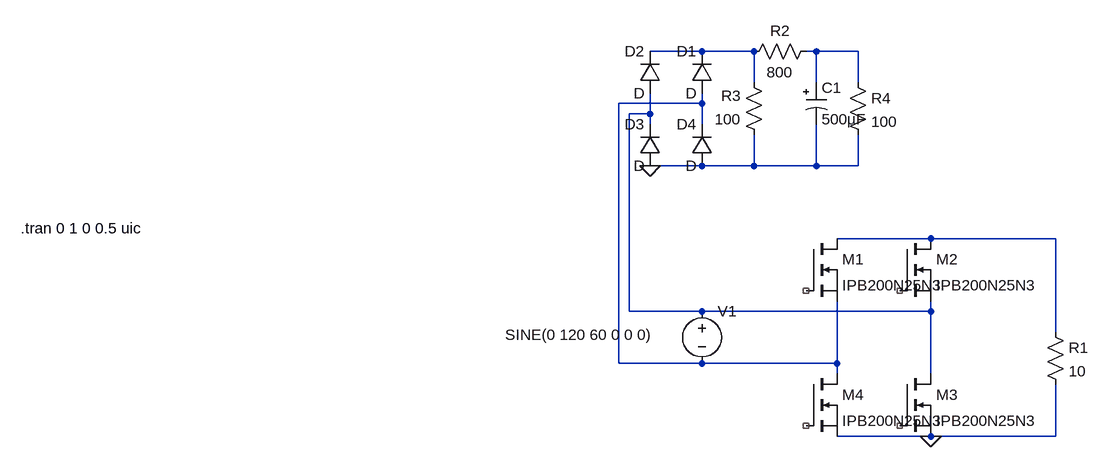
[diagram p0: schematic psu.asc]
psu.asc, the LTspice schematic file:
Version 4
SHEET 1 880 680
WIRE 80 -288 0 -288
WIRE 160 -288 80 -288
WIRE 256 -288 240 -288
WIRE 320 -288 256 -288
WIRE 160 -240 160 -288
WIRE 256 -240 256 -288
WIRE 320 -240 320 -288
WIRE 80 -208 80 -224
WIRE 80 -208 -48 -208
WIRE 0 -192 0 -224
WIRE 0 -192 -32 -192
WIRE 0 -176 0 -192
WIRE 80 -176 80 -208
WIRE 80 -112 0 -112
WIRE 160 -112 160 -160
WIRE 160 -112 80 -112
WIRE 256 -112 256 -176
WIRE 256 -112 160 -112
WIRE 320 -112 320 -160
WIRE 320 -112 256 -112
WIRE 432 0 288 0
WIRE 624 0 432 0
WIRE -32 112 -32 -192
WIRE 80 112 -32 112
WIRE 432 112 432 96
WIRE 432 112 80 112
WIRE 624 144 624 0
WIRE -48 192 -48 -208
WIRE 80 192 -48 192
WIRE 288 192 288 96
WIRE 288 192 80 192
WIRE 288 208 288 192
WIRE 432 208 432 112
WIRE 432 304 288 304
WIRE 624 304 624 224
WIRE 624 304 432 304
FLAG 432 304 0
FLAG 0 -112 0
SYMBOL voltage 80 96 R0
WINDOW 3 -303 52 Left 2
WINDOW 123 0 0 Left 0
WINDOW 39 0 0 Left 0
SYMATTR Value SINE(0 120 60 0 0 0)
SYMATTR InstName V1
SYMBOL res 608 128 R0
SYMATTR InstName R1
SYMATTR Value 10
SYMBOL nmos 240 0 R0
SYMATTR InstName M1
SYMATTR Value IPB200N25N3
SYMBOL nmos 384 0 R0
SYMATTR InstName M2
SYMATTR Value IPB200N25N3
SYMBOL nmos 384 208 R0
SYMATTR InstName M3
SYMATTR Value IPB200N25N3
SYMBOL nmos 240 208 R0
SYMATTR InstName M4
SYMATTR Value IPB200N25N3
SYMBOL diode 96 -224 R180
WINDOW 0 24 64 Left 2
WINDOW 3 24 0 Left 2
SYMATTR InstName D1
SYMBOL diode 16 -224 R180
WINDOW 0 24 64 Left 2
WINDOW 3 24 0 Left 2
SYMATTR InstName D2
SYMBOL diode 16 -112 R180
WINDOW 0 24 64 Left 2
WINDOW 3 24 0 Left 2
SYMATTR InstName D3
SYMBOL diode 96 -112 R180
WINDOW 0 24 64 Left 2
WINDOW 3 24 0 Left 2
SYMATTR InstName D4
SYMBOL res 256 -304 R90
WINDOW 0 0 56 VBottom 2
WINDOW 3 32 56 VTop 2
SYMATTR InstName R2
SYMATTR Value 800
SYMBOL res 176 -144 R180
WINDOW 0 36 76 Left 2
WINDOW 3 36 40 Left 2
SYMATTR InstName R3
SYMATTR Value 100
SYMBOL res 304 -256 R0
SYMATTR InstName R4
SYMATTR Value 100
SYMBOL polcap 240 -240 R0
SYMATTR InstName C1
SYMATTR Value 500µF
TEXT -968 -16 Left 2 !.tran 0 1 0 0.5 uic

The netlist it stands for:
* psu.asc
V1 N004 N003 SINE(0 120 60 0 0 0)
R1 N005 0 10
M1 N005 NC_01 N003 N003 IPB200N25N3
M2 N005 NC_02 N004 N004 IPB200N25N3
M3 N004 NC_03 0 0 IPB200N25N3
M4 N003 NC_04 0 0 IPB200N25N3
D1 N003 N001 D
D2 N004 N001 D
D3 0 N004 D
D4 0 N003 D
R2 N002 N001 800
R3 0 N001 100
R4 N002 0 100
C1 N002 0 500µF
.model D D
.lib standard.dio
.model NMOS NMOS
.model PMOS PMOS
.lib standard.mos
.tran 0 1 0 0.5 uic
.backanno
.end